# EAGLE design USB to TTL_V2 (EAGLE 9.6.2)
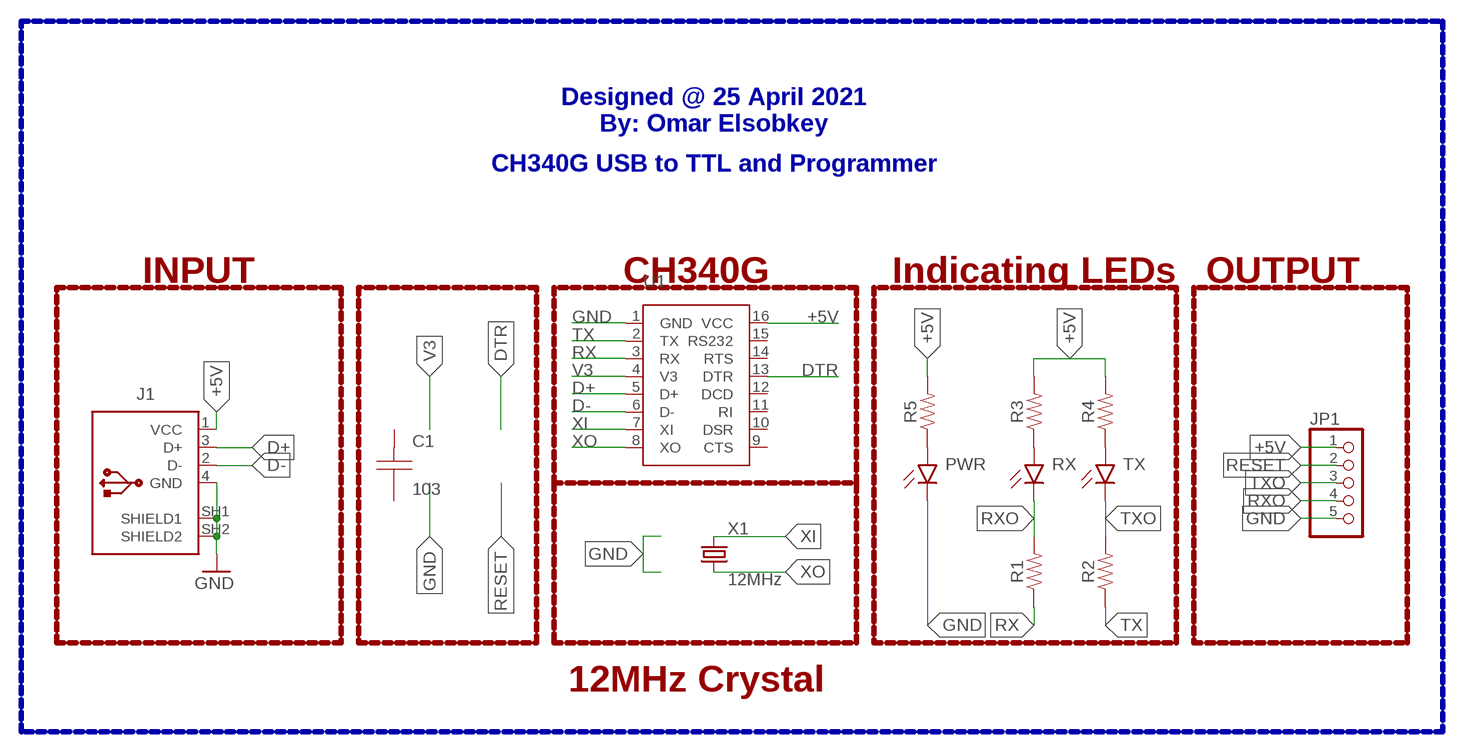
[diagram p0: schematic, sheet 1]

## Parts
C1  103  100NFP2.8  [P2.8]
J1  61729-1011  [61729-1011BLF]
JP1  PINHD-1X5/90  [1X05/90]
PWR  CHIP-FLAT-B_0805  [LEDC2012X110N_FLAT-B]
R1  1k  RESISTOR1206  [1206]
R2  1k  RESISTOR1206  [1206]
R3  102  RESISTOR1206  [1206]
R4  102  RESISTOR1206  [1206]
R5  102  RESISTOR1206  [1206]
RX  CHIP-FLAT-B_0805  [LEDC2012X110N_FLAT-B]
TX  CHIP-FLAT-B_0805  [LEDC2012X110N_FLAT-B]
U1  CH340G  [SOP-16]
X1  12MHz  49S/18PF  [XTAL_HC49]

## Nets
+5V: J1.1(VCC) JP1.1 R3.2 R4.2 R5.2 U1.16(VCC)
D+: J1.3(D+) U1.5(D+)
D-: J1.2(D-) U1.6(D-)
DTR: U1.13(DTR)
GND: J1.4(GND) J1.SH1(SHIELD1) J1.SH2(SHIELD2) JP1.5 PWR.C U1.1(GND)
N$1: R3.1 RX.A
N$2: R4.1 TX.A
N$3: PWR.A R5.1
RESET: JP1.2
RX: R1.1 U1.3(RX)
RXO: JP1.4 R1.2 RX.C
TX: R2.1 U1.2(TX)
TXO: JP1.3 R2.2 TX.C
V3: U1.4(V3)
XI: U1.7(XI) X1.2
XO: U1.8(XO) X1.1
Unconnected: C1.1(A1) C1.2(K1) U1.9(CTS) U1.10(DSR) U1.11(RI) U1.12(DCD) U1.14(RTS) U1.15(RS232)

## Buses
B$1

## Notes on the sheet
- Designed @ 25 April 2021
  By: Omar Elsobkey
- CH340G USB to TTL and Programmer
- INPUT | CH340G | Indicating LEDs | OUTPUT
- 12MHz Crystal

## Library data of the parts
C1 = Capacitors:100NF
J1 = Connector_USB:61729-1011: USB(2.0) Type-B, RCPT, 4POS, THT-R/A Datasheet <https://www.amphenol-icc.com/media/wysiwyg/files/drawing/61729.pdf>; CATEGORY: Connector; CONTACTS: 4; CURRENT_RATING: 1A; DESCRIPTION: CONN RCPT USB2.0 TYPEB 4POS R/A; GENDER: Receptacle; MANUFACTURER: Amphenol ICC (FCI); MOUNT_TYPE: R/A; MPN: 61729-1011BLF; OPERATING_TEMP: -55°C to 85°C; PART_STATUS: Active; ROHS_COMPLIANT: RoHS Compliant; SERIES: 61729; SUB-CATEGORY: USB; TYPE: USB-B
JP1 = pinhead:PINHD-1X5: PIN HEADER
PWR RX TX = LED:CHIP-FLAT-B; CATEGORY: LED; COLOR: BLUE; DESCRIPTION: CHIP LED FLAT; SUB-CATEGORY: CHIP; TYPE: FLAT_TOP; VALUE: LED_BLUE
R1-R5 = SparkFun-Resistors:RESISTOR: Generic Resistor Package
U1 = CH340G:CH340G
X1 = Crystals_Oscillators:49S/18PF: Crystal Manufacturer's datasheet <https://datasheet.octopart.com/49S-18PF-Xinhunjing-datasheet-30677139.pdf>; CREATED_BY: PCBLayout.com; MANUFACTURER: Xinhunjing; MPN: 49S/18PF; PACKAGE: SMD

## Board
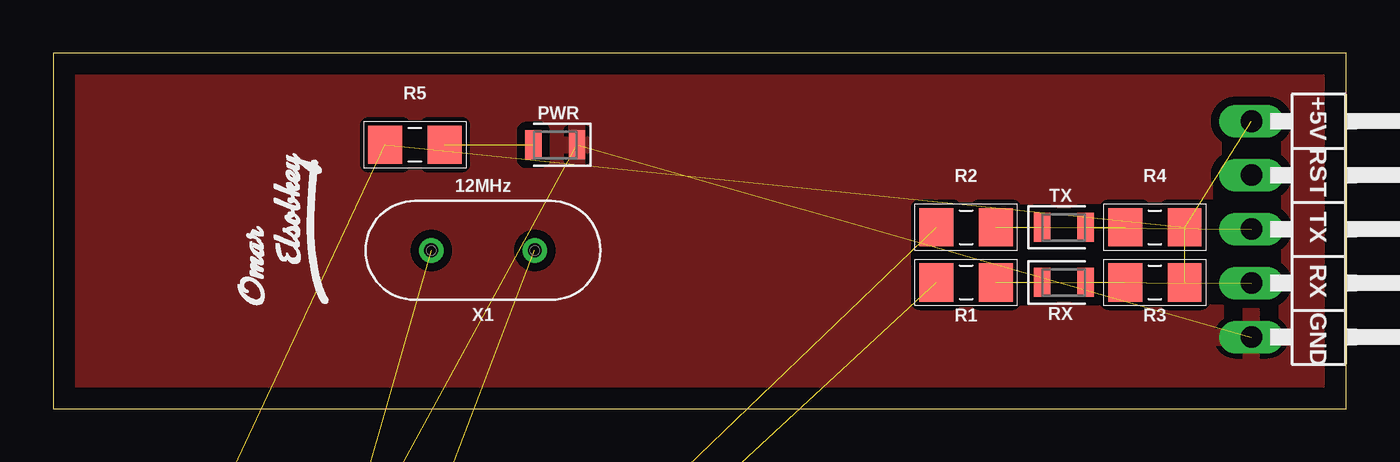
[diagram p1: board, top side]
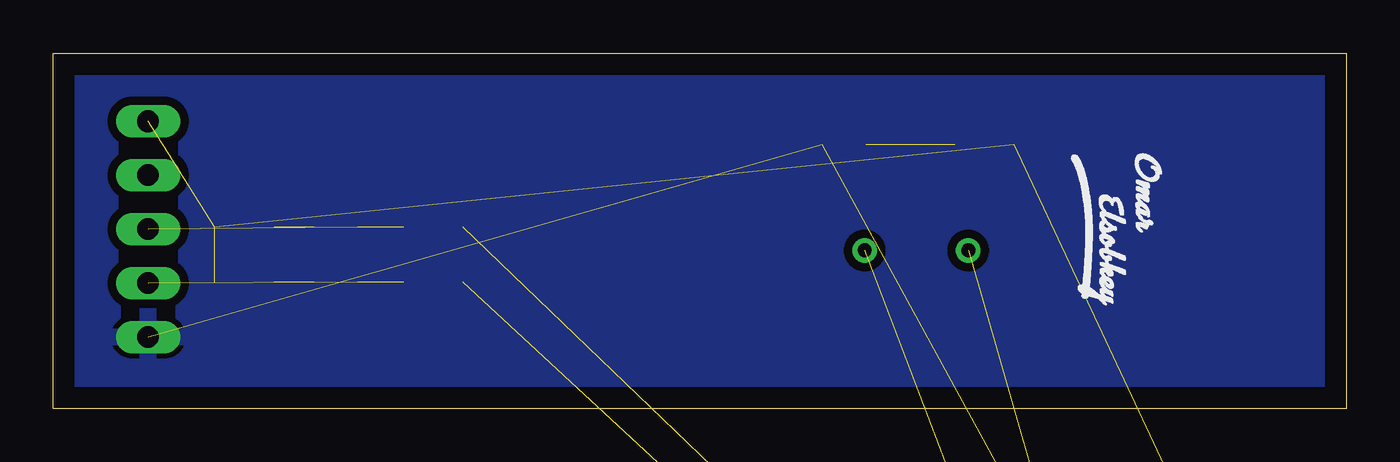
[diagram p2: board, bottom side, seen from below]

Size 60.91 x 16.74 mm. Coordinates in mm from the lower left corner, seen from the top.
Outline: 0,0 60.91,0 60.91,16.74 0,16.74 0,0
Copper layers (1*16): Top 0.035mm / dielectric 1.5mm / Bottom 0.035mm
Design rules "default *": minimum track width 0.3mm, minimum drill 0.4mm, track to track 0.3mm, track to pad 0.3mm, pad to pad 0.3mm, via to via 0.3mm, smd to smd 0.3mm, copper to edge 40mil, drill to drill 6mil, minimum pad ring 10mil, minimum via ring 8mil, stop-mask expansion 4mil, vias tented up to drill 0mil, thermal gap 10mil

### Footprints (pad centres in the part's own frame; a part is rotated, then mirrored left to right if it is on the bottom)
P2.8 = drill 0.7 pad 1.7: 1 -1.397,0; 2 1.397,0
61729-1011BLF = drill 0.7 pad 1.4 octagon: 1 1.25,4.71; 2 -1.25,4.71; 3 -1.25,2.71; 4 1.25,2.71 | drill 2.3 pad 3.8: SH1 -6.02,0; SH2 6.02,0
1X05/90 = drill 1.016 long: 1 -5.08,-3.81; 2 -2.54,-3.81; 3 0,-3.81; 4 2.54,-3.81; 5 5.08,-3.81
LEDC2012X110N_FLAT-B = smd 0.762 x 1.362: A 1.025,0; C -1.025,0
1206 = smd 1.6 x 1.8: 1 -1.4,0; 2 1.4,0
SOP-16 = smd 0.635 x 1.524: 1 -4.445,-2.695; 2 -3.175,-2.695; 3 -1.905,-2.695; 4 -0.635,-2.695; 5 0.635,-2.695; 6 1.905,-2.695; 7 3.175,-2.695; 8 4.445,-2.695; 9 4.445,2.695; 10 3.175,2.695; 11 1.905,2.695; 12 0.635,2.695; 13 -0.635,2.695; 14 -1.905,2.695; 15 -3.175,2.695; 16 -4.445,2.695
XTAL_HC49 = drill 0.65 pad 1.05: 1 -2.44,0; 2 2.44,0

### Placement (x,y rotation side)
C1  -6.78,-28.07 0 top  (outside the outline)
J1  4.19,-14.07 0 top  (outside the outline)
JP1  60.25,8.45 270 top
PWR  23.65,12.42 180 top
R1  43,5.94 0 top
R2  43,8.53 0 top
R3  51.89,5.94 0 top
R4  51.89,8.53 0 top
R5  17.04,12.42 180 top
RX  47.6,5.94 0 top
TX  47.6,8.53 0 top
U1  3.58,-28.32 0 top  (outside the outline)
U$1  [OMAR_ELSOBKEY_X0.5_TN]  11.02,8.1 90 top
U$2  [OMAR_ELSOBKEY_X0.5_TN]  11.02,8.79 270 bottom
X1  20.25,7.45 180 top

### Tracks (layer width: path | path; a pad name or v marks a point on that pad's centre or on a via)
+5V  (5 unrouted)
D+  (1 unrouted)
D-  (1 unrouted)
GND  (5 unrouted)
  pour Top (isolate 0.4): -1.6,24.31 74.93,24.31 74.93,-2.39 -1.6,-2.39
  pour Bottom (isolate 0.4): -3.45,25.7 76.2,25.7 76.2,-3.45 -3.45,-3.45
N$1  (1 unrouted)
N$2  (1 unrouted)
N$3  (1 unrouted)
RX  (1 unrouted)
RXO  (2 unrouted)
TX  (1 unrouted)
TXO  (2 unrouted)
XI  (1 unrouted)
XO  (1 unrouted)

### Text on the board
tNames: +5V RST TX RX GND